# EAGLE design TempProbeProgrammer (EAGLE 7.3.0)
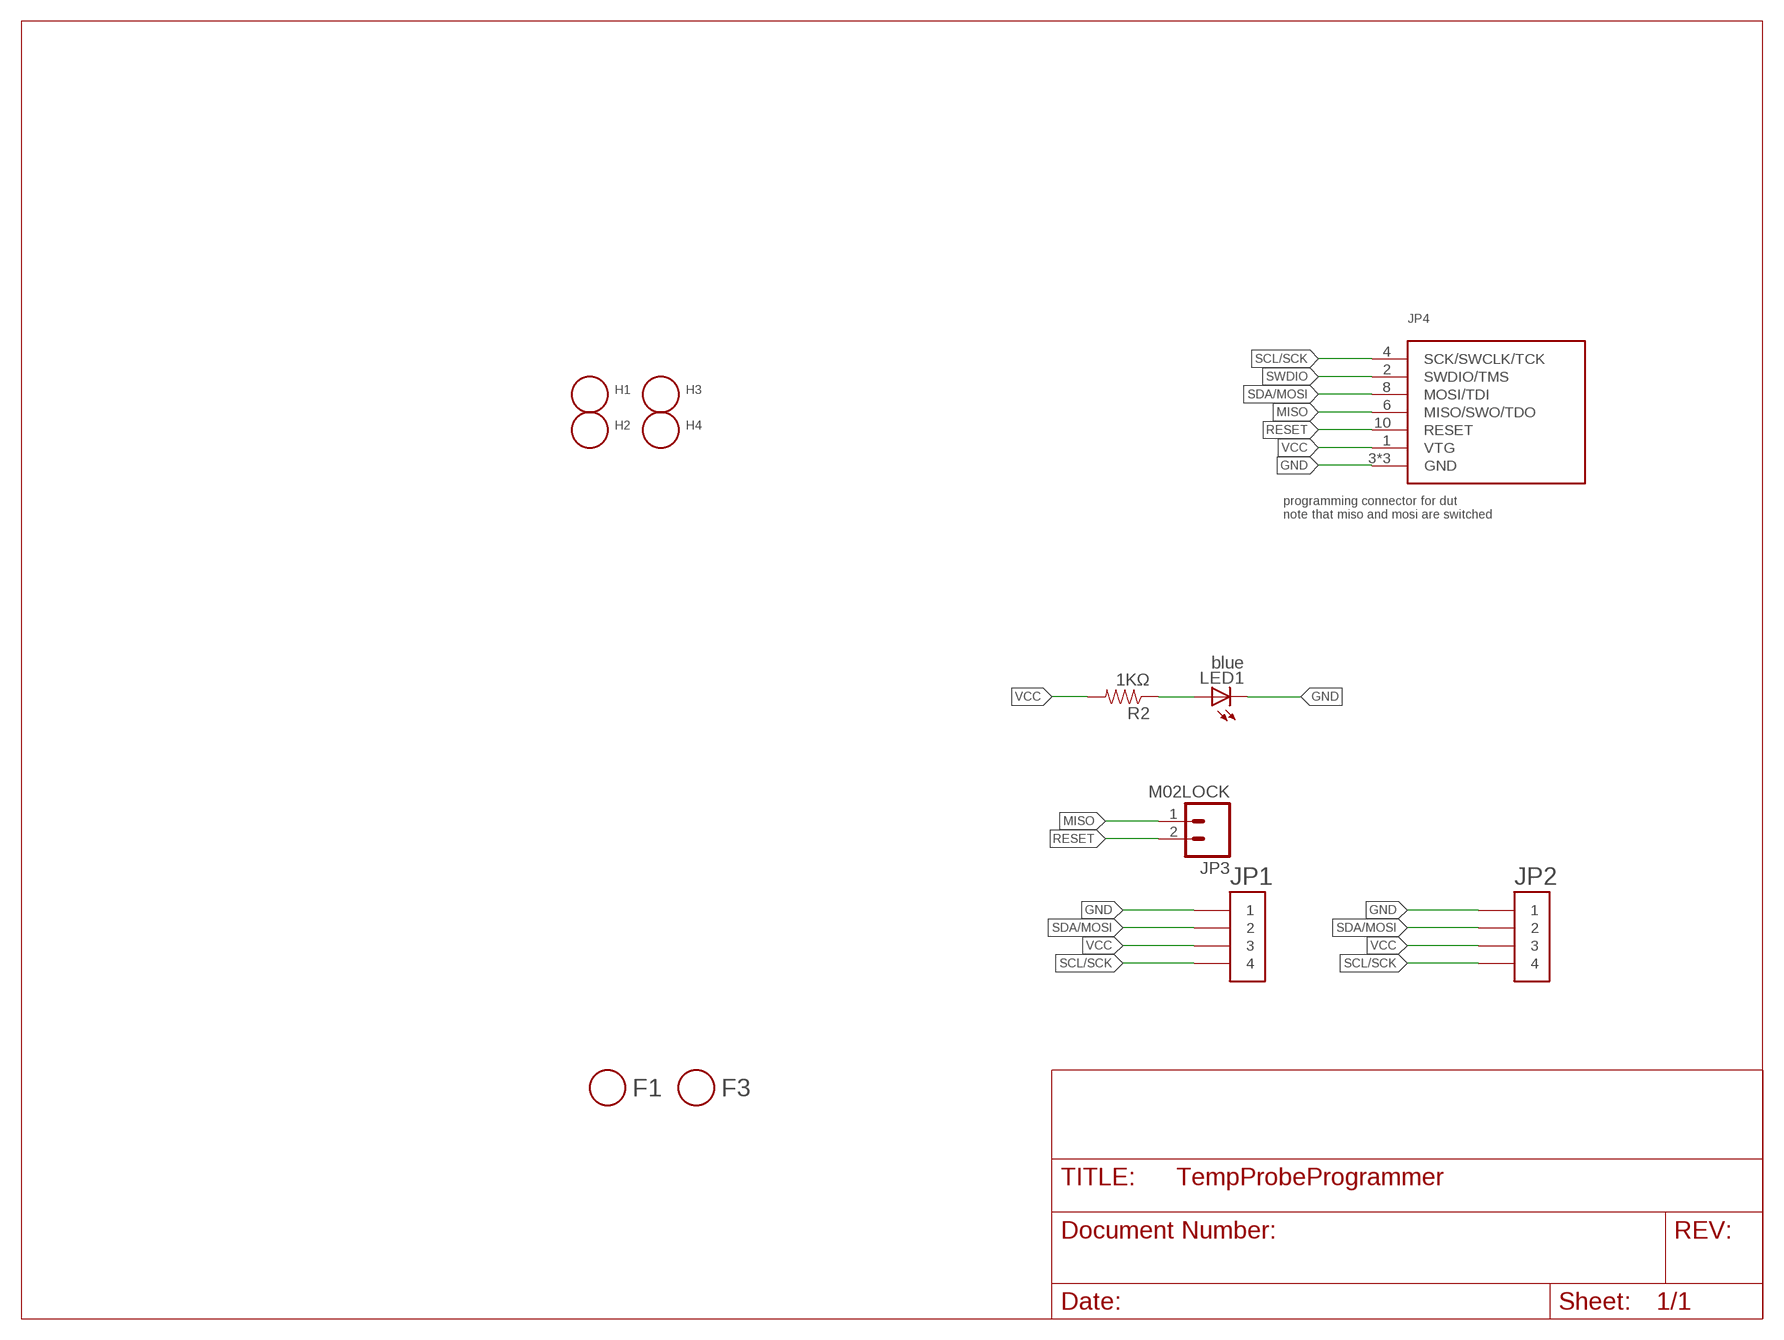
[diagram p0: schematic, sheet 1]
FRAME1 (LETTER_L): BOM: EXCLUDE

## Parts
F1  FIDUCIAL  [FIDUCIAL_1MM]
F3  FIDUCIAL  [FIDUCIAL_1MM]
H1  HOLE#4  [HOLE-#4]
H2  HOLE#4  [HOLE-#4]
H3  HOLE#4  [HOLE-#4]
H4  HOLE#4  [HOLE-#4]
JP1  HEADER-1X4-JST-PA-SIDE-SMD  [JST-PA-SIDE-SMD]
JP2  HEADER-1X4-JST-PA-SIDE-SMD  [JST-PA-SIDE-SMD]
JP3  M02LOCK  [1X02_LOCK]
JP4  ICSP  [2X5-.05]
LED1  blue  LED-0805-BLUE  [0805-LED]
R2  1KΩ  RESISTOR-1KΩ  [0603]

## Nets
GND: JP1.1 JP2.1 JP4.3(GND) JP4.5(GND) JP4.9(GND) LED1.C
MISO: JP3.1 JP4.6(MISO/SWO/TDO)
N$2: LED1.A R2.1
RESET: JP3.2 JP4.10(RESET)
SCL/SCK: JP1.4 JP2.4 JP4.4(SCK/SWCLK/TCK)
SDA/MOSI: JP1.2 JP2.2 JP4.8(MOSI/TDI)
SWDIO: JP4.2(SWDIO/TMS)
VCC: JP1.3 JP2.3 JP4.1(VTG) R2.2
Unconnected: H1.P$1(HOLE) H2.P$1(HOLE) H3.P$1(HOLE) H4.P$1(HOLE)

## Notes on the sheet
- programming connector for dut
  note that miso and mosi are switched

## Library data of the parts
F1 F3 = Modulo:FIDUCIAL; BOM: EXCLUDE
H1-H4 = Modulo:HOLE; PARTNUM: EXCLUDE
JP1 JP2 = Modulo:HEADER-1X4; PARTNUM: SM04B-PASS-TBT(LF)(SN)
JP3 = SparkFun-Connectors:M02: Standard 2-pin 0.1" header. Use with - straight break away headers ( PRT-00116) - right angle break away headers (PRT-00553) - swiss pins (PRT-00743) - machine pins (PRT-00117) - female headers (PRT-00115) Molex polarized connector foot print use with: PRT-08233 with associated crimp pins and housings. 2.54_SCREWTERM for use with PRT-10571. 3.5mm Screw Terminal footprints for PRT-08084 5mm Screw Terminal footprints for use with PRT-08433; PARTNUM: EXCLUDE
JP4 = Modulo:ICSP
LED1 = Modulo:LED: LED; PARTNUM: LTST-C171TBKT
R2 = Modulo:RESISTOR: Resistor Basic schematic elements and footprints for 0603, 1206, and PTH resistors.; PARTNUM: ERJ-3EKF1001V

## Board
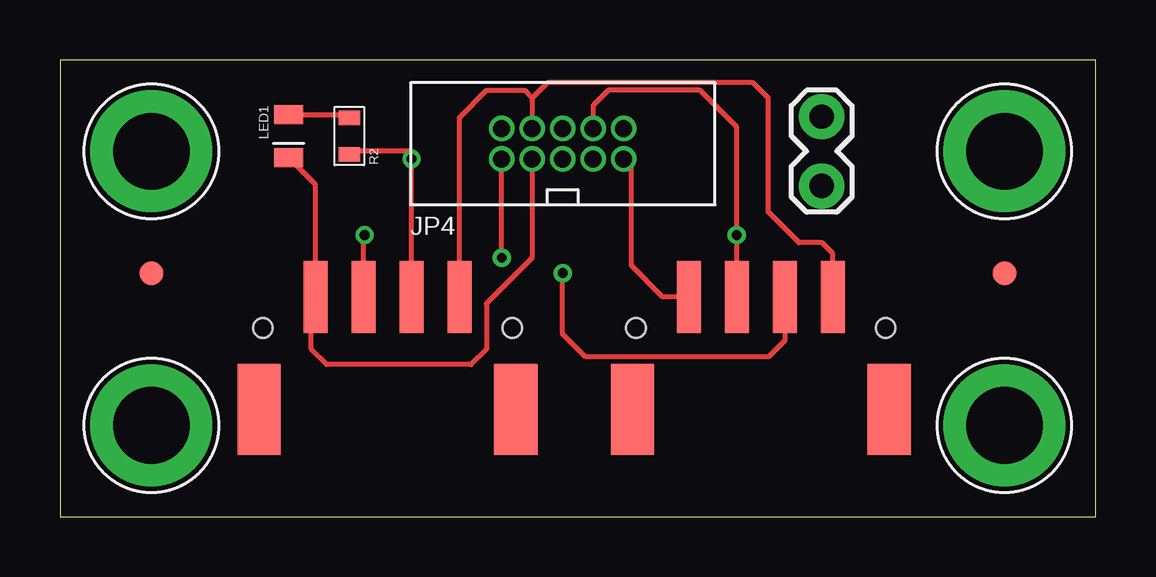
[diagram p1: board, top side]
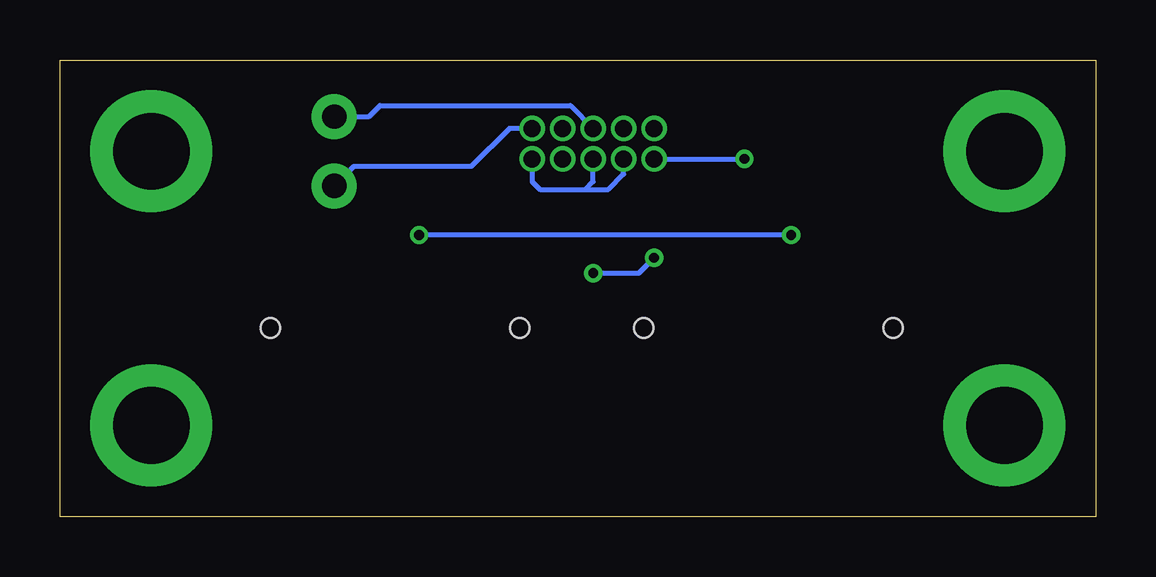
[diagram p2: board, bottom side, seen from below]

Size 43.18 x 19.05 mm. Coordinates in mm from the lower left corner, seen from the top.
Outline: 43.18,0 43.18,19.05 8.89,19.05 8.88,19.04 0,19.04 0,0 43.16,0
Copper layers (1*16): Top 0.0356mm / dielectric 1.5011mm / Bottom 0.0356mm
Design rules "LaenPCBOrder": minimum track width 6mil, minimum drill 13mil, track to track 6mil, track to pad 6mil, pad to pad 6mil, via to via 6mil, smd to smd 6mil, copper to edge 15mil, drill to drill 6mil, minimum pad ring 7mil, minimum via ring 7mil, stop-mask expansion 3mil, vias tented up to drill 0mil, thermal gap 10mil

### Footprints (pad centres in the part's own frame; a part is rotated, then mirrored left to right if it is on the bottom)
FIDUCIAL_1MM = smd 1 x 1: 1 0,0
HOLE-#4 = drill 3.198 pad 5.08: P$1 0,0
JST-PA-SIDE-SMD = smd 1 x 3: 1 -3,9.174; 2 -1,9.174; 3 1,9.174; 4 3,9.174 | smd 1.8 x 3.8: R1 -5.35,4.474; R2 5.35,4.474 | hole 0.8: 5.2,7.874; -5.2,7.874
1X02_LOCK = drill 1.016 pad 1.88: 1 -0.178,0; 2 2.718,0
2X5-.05 = drill 0.711 pad 1.016: 1 -2.54,-1.27; 2 -2.54,0; 3 -1.27,-1.27; 4 -1.27,0; 5 0,-1.27; 6 0,0; 7 1.27,-1.27; 8 1.27,0; 9 2.54,-1.27; 10 2.54,0
0805-LED = smd 1.2 x 0.8: A 0,-0.9; C 0,0.9
0603 = smd 0.61 x 0.889: 1 -0.762,0; 2 0.762,0

### Placement (x,y rotation side)
F1  39.37,10.16 0 top
F3  3.81,10.16 0 top
H1  39.37,15.24 0 top
H2  3.81,15.24 0 top
H3  3.81,3.81 0 top
H4  39.37,3.81 0 top
JP1  13.65,0 0 top
JP2  29.21,0 0 top
JP3  31.75,16.51 270 top
JP4  20.95,16.19 0 top
LED1  9.53,15.88 180 top
R2  12.06,15.88 270 top

### Tracks (layer width: path | path; a pad name or v marks a point on that pad's centre or on a via)
GND
  Top 0.203: LED1.C 10.65,13.85 JP1.1 10.48,9 10.48,6.99 11.11,6.35 17.14,6.35 17.78,6.99 17.78,8.89 19.68,10.79 JP4.3 | JP2.1 25.12,9.17 23.81,10.48 23.81,14.61 JP4.9
  Bottom 0.203: JP4.9 23.5,13.97 23.18,13.65 21.27,13.65 | 21.27,13.65 20.95,13.97 JP4.5 | 21.27,13.65 20.32,13.65 19.68,14.29 JP4.3
MISO
  Bottom 0.203: JP3.1 30.3,16.69 29.84,17.14 21.91,17.14 JP4.6
N$2
  Top 0.203: LED1.A 11.93,16.77 R2.1
RESET
  Bottom 0.203: JP4.10 24.45,16.19 26.04,14.61 30.94,14.61 JP3.2
SCL/SCK
  Top 0.203: JP1.4 16.65,16.65 17.78,17.78 19.37,17.78 19.68,17.46 | 19.68,17.46 JP4.4 | JP2.4 32.21,10.97 31.75,11.43 30.8,11.43 29.53,12.7 29.53,17.46 28.89,18.1 20.32,18.1 19.68,17.46
SDA/MOSI  (via drill 0.41)
  Top 0.203: JP2.2 v28.21,11.75 28.21,16.24 26.67,17.78 22.86,17.78 22.23,17.14 JP4.8 | JP1.2 12.65,11.7 v12.7,11.75
  Bottom 0.203: v12.7,11.75 v28.21,11.75
VCC  (via drill 0.41)
  Top 0.203: JP1.3 v14.65,14.92 14.65,15.19 14.61,15.24 12.19,15.24 R2.2 | JP2.3 30.21,7.35 29.53,6.67 21.91,6.67 20.95,7.62 v20.95,10.16 | v18.41,10.79 JP4.1
  Bottom 0.203: JP4.1 v14.65,14.92 | v20.95,10.16 19.05,10.16 v18.41,10.79